# EAGLE design bq25504 (EAGLE 7.3.0)
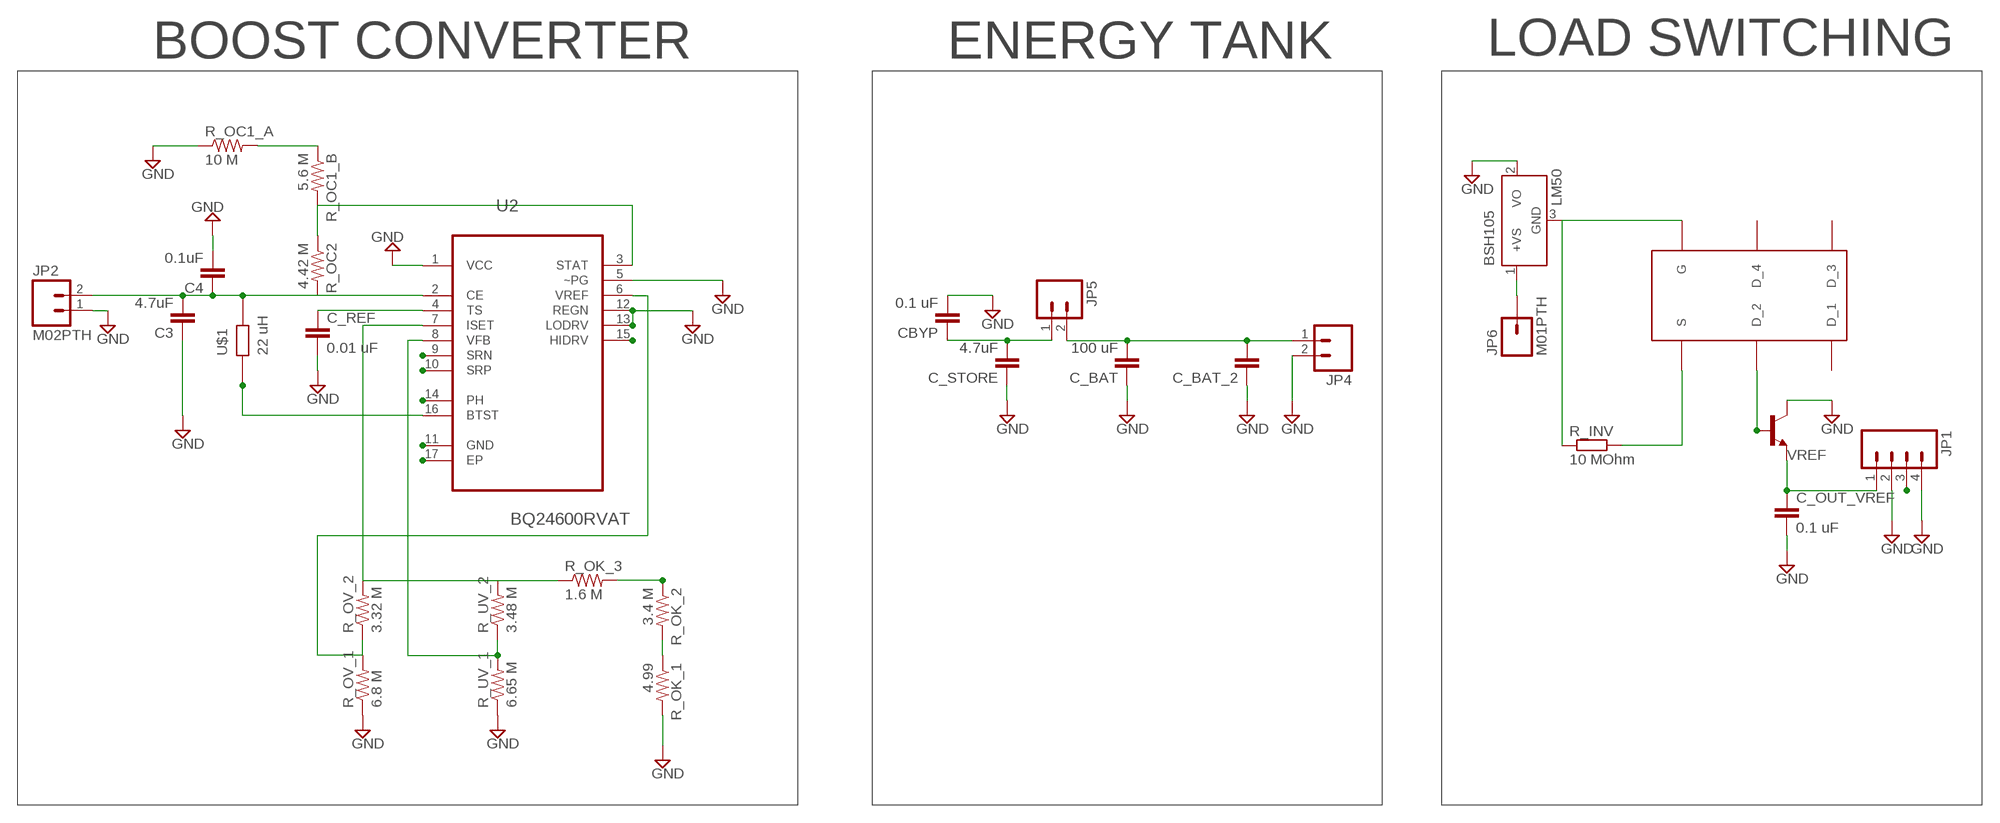
[diagram p0: schematic, sheet 1]

## Parts
BSH105  LM50  [SOT23]
BSH207  BSH_105_NMOS_DEV  [SOT457]
C3  4.7uF  1.0UF-25V-+80/-20(0805)  [0805]
C4  0.1uF  1.0UF-25V-+80/-20(0805)  [0805]
C_BAT  100 uF  CAP0805  [0805]
C_BAT_2  CAP1210  [1210]
C_OUT_VREF  0.1 uF  12PF-50V-5%(0603)  [0603-CAP]
C_REF  0.01 uF  CAP0805  [0805]
C_STORE  4.7uF  1.0UF-25V-+80/-20(0805)  [0805]
CBYP  0.1 uF  CAP0805  [0805]
JP1  M04LOCK  [1X04_LOCK]
JP2  M02PTH  [1X02]
JP4  M02PTH  [1X02]
JP5  M02PTH  [1X02]
JP6  M01PTH  [1X01]
R_INV  10 MOhm  R-EU_R0603  [R0603]
R_OC1_A  10 M  RESISTOR0805-RES  [0805]
R_OC1_B  5.6 M  RESISTOR0805-RES  [0805]
R_OC2  4.42 M  RESISTOR0805-RES  [0805]
R_OK_1  4.99  RESISTOR0805-RES  [0805]
R_OK_2  3.4 M  RESISTOR0805-RES  [0805]
R_OK_3  1.6 M  RESISTOR0805-RES  [0805]
R_OV_1  6.8 M  RESISTOR0805-RES  [0805]
R_OV_2  3.32 M  RESISTOR0805-RES  [0805]
R_UV_1  6.65 M  RESISTOR0805-RES  [0805]
R_UV_2  3.48 M  RESISTOR0805-RES  [0805]
U2  BQ24600RVAT  [QFN50P350X350X100-17N]
U$1  22 uH  LPS4018  [LPS4018]
VREF_1.8  TRANSISTOR_NPNSOT23-3  [SOT23-3]

## Nets
9_PIN: R_OK_2.1 R_OK_3.2 U2.9(SRN)
10_PIN: R_OK_1.1 R_OK_2.2 U2.10(SRP)
BAT_OK: BSH105.1(+VS) JP6.1 U2.11(GND)
BOOST_OUT: BSH207.2(D_2) JP1.3 VREF_1.8.1(B)
GND: BSH105.2(VO) C3.1 C4.2 C_BAT.1 C_BAT_2.1 C_OUT_VREF.2 C_REF.2 C_STORE.1 CBYP.2 JP1.2 JP1.4 JP2.1 JP4.2 R_OC1_A.1 R_OK_1.2 R_OV_1.1 R_UV_1.1 U2.1(VCC) U2.5(~PG) U2.12(REGN) U2.13(LODRV) VREF_1.8.3(C)
J: U2.16(BTST) U$1.A
N$5: C3.2 C4.1 JP2.2 R_OC2.2 U2.2(CE) U$1.B
N$9: R_OV_1.2 R_OV_2.1 U2.6(VREF)
N$11: R_OC1_B.2 R_OC2.1 U2.3(STAT)
N$13: R_UV_1.2 R_UV_2.1 U2.8(VFB)
N$14: C_REF.1 U2.4(TS)
N$15: R_OC1_A.2 R_OC1_B.1
N$16: C_OUT_VREF.1 JP1.1 VREF_1.8.2(E)
N$17: BSH105.3(GND) BSH207.3(G) R_INV.1
N$18: U2.17(EP)
V_BAT: BSH207.4(S) C_BAT.2 C_BAT_2.2 JP4.1 JP5.2 R_INV.2 U2.14(PH)
V_STORE: C_STORE.2 CBYP.1 JP5.1 U2.15(HIDRV)
WIRE: R_OK_3.1 R_OV_2.2 R_UV_2.2 U2.7(ISET)
Unconnected: BSH207.1(D_1) BSH207.5(D_3) BSH207.6(D_4)

## Notes on the sheet
- LOAD SWITCHING
- BOOST CONVERTER | ENERGY TANK
- VREF

## Library data of the parts
BSH105 = linear:LM50: SOT-23 Single-Supply Centigrade Temperature Sensor Vout = (10mV/°C x Temp °C) +5mmmV Source: http://cache.national.com/ds/LM/LM50.pdf
BSH207 = SparkFun-DiscreteSemi:BSH_105_NMOS_DEV: NXP BSH205 P_MOS Package SOT457 Type PMOS MOSFET TRANSISTOR WARNING! TYPO ON DEVICE NAME. IT IS BSH205_PMOS
C3 C4 C_STORE = SparkFun-Capacitors:1.0UF-25V-+80/-20(0805): CAP-11625; PROD_ID: CAP-11625; VALUE: 1.0uF
C_BAT C_REF CBYP = SparkFun:CAP: Capacitor Standard 0603 ceramic capacitor, and 0.1" leaded capacitor.
C_BAT_2 = SparkFun-Capacitors:CAP: Capacitor Standard 0603 ceramic capacitor, and 0.1" leaded capacitor.
C_OUT_VREF = SparkFun-Capacitors:12PF-50V-5%(0603): CAP-09137; PROD_ID: CAP-09137; VALUE: 12pF
JP1 = SparkFun-Connectors:M04: Header 4 Standard 4-pin 0.1" header. Use with straight break away headers (SKU : PRT-00116), right angle break away headers (PRT-00553), swiss pins (PRT-00743), machine pins (PRT-00117), and female headers (PRT-00115). Molex polarized connector foot print use with SKU : PRT-08231 with associated crimp pins and housings. 1MM SMD Version SKU: PRT-10208
JP2 = SparkFun-Connectors:M02: Standard 2-pin 0.1" header. Use with - straight break away headers ( PRT-00116) - right angle break away headers (PRT-00553) - swiss pins (PRT-00743) - machine pins (PRT-00117) - female headers (PRT-00115) Molex polarized connector foot print use with: PRT-08233 with associated crimp pins and housings. 2.54_SCREWTERM for use with PRT-10571. 3.5mm Screw Terminal footprints for PRT-08084 5mm Screw Terminal footprints for use with PRT-08432
JP4 JP5 = SparkFun:M02: Header 2 Standard 2-pin 0.1" header. Use with straight break away headers (SKU : PRT-00116), right angle break away headers (PRT-00553), swiss pins (PRT-00743), machine pins (PRT-00117), and female headers (PRT-00115). Molex polarized connector foot print use with SKU : PRT-08233 with associated crimp pins and housings.
JP6 = SparkFun:M01: Header 1 Standard 1-pin 0.1" header. Use with straight break away headers (SKU : PRT-00116), right angle break away headers (PRT-00553), swiss pins (PRT-00743), machine pins (PRT-00117), and female headers (PRT-00115).
R_INV = rcl:R-EU_: RESISTOR, European symbol
R_OC1_A R_OC1_B R_OC2 R_OK_1-R_OK_3 R_OV_1 R_OV_2 R_UV_1 R_UV_2 = SparkFun-Resistors:RESISTOR: Resistor Basic schematic elements and footprints for 0603, 1206, and PTH resistors.
U2 = Texas Instruments_By_element14_Batch_1:BQ24600RVAT: Synchronous Switch-Mode Li-Ion or Li-Polymer Battery Charger; MPN: BQ24600RVAT; OC_FARNELL: -; OC_NEWARK: 72R5026; PACKAGE: VQFN-16; SUPPLIER: Texas Instruments
U$1 = 3DRobotics_Master_Library:LPS4018: Coilcraft Shielded SMT power inductor 15uH inductor for LM2842 switching regulator application circuit.; DATASHEET: http://www.coilcraft.com/pdf_viewer/showpdf.cfm?f=pdf_store:lps4018.pdf; LINK: http://www.coilcraft.com/lps4018.cfm; MFGPN: LPS4018-153MLB
VREF_1.8 = SparkFun:TRANSISTOR_NPN: Transistor NPN BJT configuration in SOT23 package. MMBT2222 is the common NPN we use. Double check BCE configuration again layout.

## Board
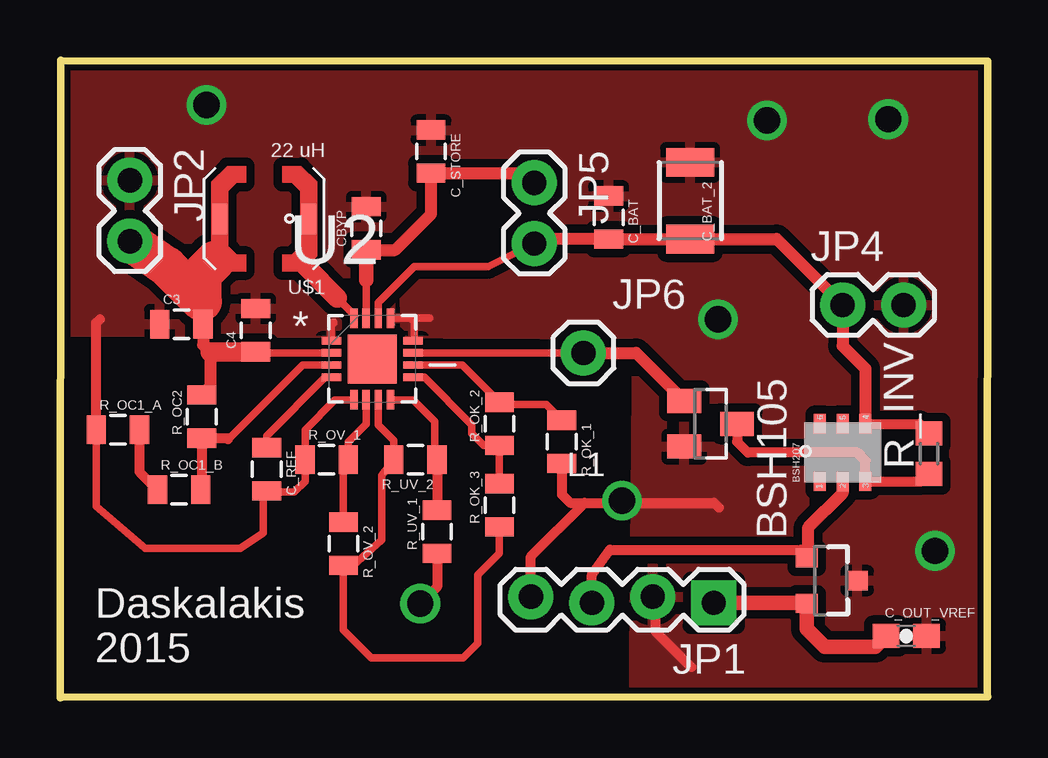
[diagram p1: board, top side]
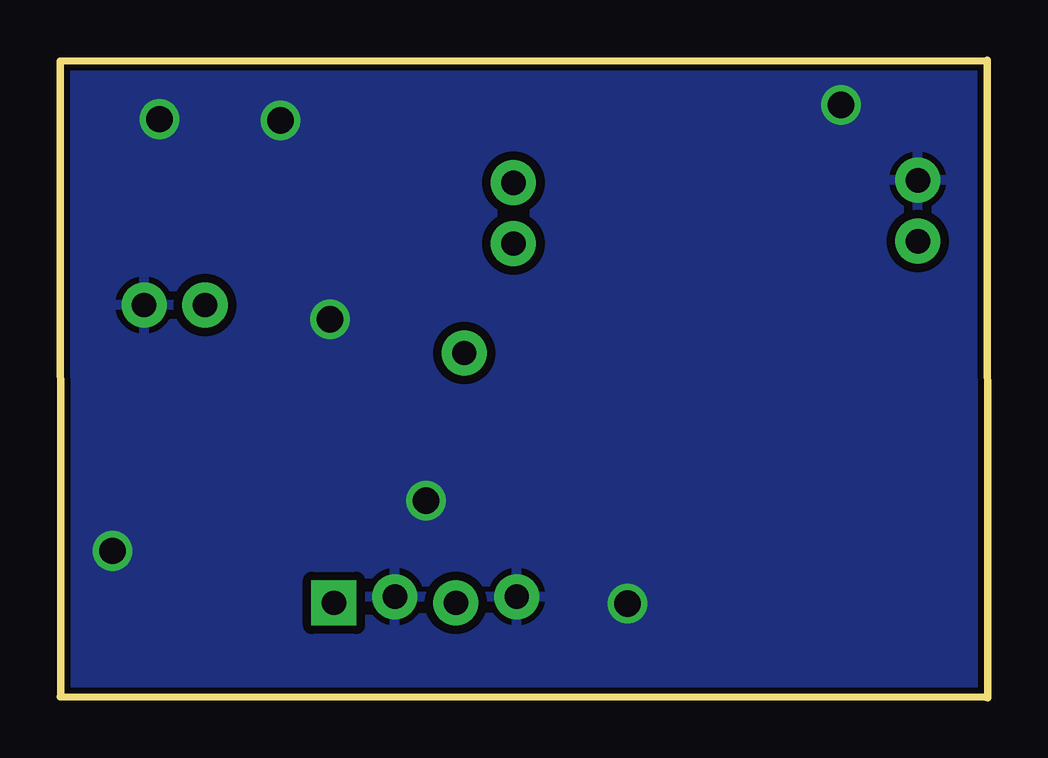
[diagram p2: board, bottom side, seen from below]

Size 38.65 x 26.59 mm. Coordinates in mm from the lower left corner, seen from the top.
Outline: 38.65,26.54 38.63,0.14
Outline: 0.03,26.59 0,0
Outline: 38.65,26.54 0.03,26.55
Outline: 0.07,0.02 38.65,0.03
Copper layers (1*16): Top 0.035mm / dielectric 1.5mm / Bottom 0.035mm
Design rules "Fusion_eagle_rule_v1.1 *": minimum track width 12mil, minimum drill 12mil, track to track 14mil, track to pad 14mil, pad to pad 14mil, via to via 14mil, smd to smd 0mil, copper to edge 10mil, drill to drill 10mil, minimum pad ring 10mil, minimum via ring 6mil, stop-mask expansion 2mil, vias tented up to drill 100mil, thermal gap 10mil

### Footprints (pad centres in the part's own frame; a part is rotated, then mirrored left to right if it is on the bottom)
SOT23 = smd 1 x 1.4: 1 -0.95,-1.1; 2 0.95,-1.1; 3 0,1.1
SOT457 = smd 0.8 x 0.5: 1 -1.2,0.95; 2 -1.2,0; 3 -1.2,-0.95; 4 1.2,-0.95; 5 1.2,0; 6 1.2,0.95
0805 = smd 0.8 x 1.2: 1 -0.9,0; 2 0.9,0
1210 = smd 1.2 x 2: 1 -1.6,0; 2 1.6,0
0603-CAP = smd 1.1 x 1: 1 -0.85,0; 2 0.85,0
1X04_LOCK = drill 1.016 pad 1.88 square: 1 0,0.127 | drill 1.016 pad 1.88: 2 2.54,-0.127; 3 5.08,0.127; 4 7.62,-0.127
1X02 = drill 1.016 pad 1.88: 1 0,0; 2 2.54,0
1X01 = drill 1.016 pad 1.88: 1 0,0
R0603 = smd 1 x 1.1: 1 -0.85,0; 2 0.85,0
QFN50P350X350X100-17N = smd 0.813 x 0.305: 1 -1.702,0.762; 2 -1.702,0.254; 3 -1.702,-0.254; 4 -1.702,-0.762; 9 1.702,-0.762; 10 1.702,-0.254; 11 1.702,0.254; 12 1.702,0.762 | smd 0.305 x 0.813: 5 -0.762,-1.702; 6 -0.254,-1.702; 7 0.254,-1.702; 8 0.762,-1.702; 13 0.762,1.702; 14 0.254,1.702; 15 -0.254,1.702; 16 -0.762,1.702 | smd 2.032 x 2.032: 17 0,0
LPS4018 = smd 0.635 x 1.27: A -1.85,0; B 1.85,0
SOT23-3 = smd 0.8 x 0.9: 1 -0.95,-1; 2 0.95,-1; 3 0,1.1

### Placement (x,y rotation side)
BSH105  27.11,11.42 270 top
BSH207  32.61,10.22 90 top
C3  5.06,15.57 0 top
C4  8.16,15.32 90 top
C_BAT  22.86,20.02 270 top
C_BAT_2  26.26,20.72 270 top
C_OUT_VREF  35.26,2.57 0 top
C_REF  8.61,9.52 270 top
C_STORE  15.46,22.77 270 top
CBYP  12.76,19.57 90 top
JP1  27.24,4.08 180 top
JP2  2.91,21.57 270 top
JP4  32.61,16.37 0 top
JP5  19.76,21.47 270 top
JP6  21.81,14.37 0 top
R_INV  36.21,10.17 90 top
R_OC1_A  2.41,11.17 0 top
R_OC1_B  4.96,8.67 0 top
R_OC2  5.91,11.72 90 top
R_OK_1  20.91,10.67 270 top
R_OK_2  18.31,11.42 90 top
R_OK_3  18.31,8.02 90 top
R_OV_1  11.11,9.92 0 top
R_OV_2  11.81,6.42 270 top
R_UV_1  15.71,6.92 90 top
R_UV_2  14.81,9.92 180 top
U2  13.01,14.12 0 top
U$1  8.51,19.97 180 top
VREF_1.8  32.11,4.88 270 top

### Tracks (layer width: path | path; a pad name or v marks a point on that pad's centre or on a via)
9_PIN
  Top 0.305: U2.9 15.17,13.36 17.16,11.37 17.16,11.02 17.66,10.52 R_OK_2.1 R_OK_3.2
10_PIN
  Top 0.305: U2.10 16.76,13.87 R_OK_2.2 18.41,12.32 18.51,12.22 20.26,12.22 R_OK_1.1
BAT_OK
  Top 0.305: U2.11 JP6.1
  Top 0.5: JP6.1 24.01,14.37 BSH105.1
BOOST_OUT
  Top 0.406: JP1.3 22.16,5.12 22.91,6.17 30.87,6.17 VREF_1.8.1
  Top 0.5: BSH207.2 32.61,8.52 31.16,7.07 31.16,5.88 VREF_1.8.1
GND  (via drill 1.1)
  Top 0.305: 11.36,15.57 11.31,15.57 U2.1 11.31,15.52 11.36,15.57 | 11.36,15.57 11.41,15.62 11.36,15.62 | U2.5 11.46,12.42 10.21,11.17 R_OV_1.1 10.21,9.02 9.76,8.57 8.66,8.57 | 8.66,8.57 C_REF.2 | 8.66,8.57 8.51,8.57 8.46,8.62 8.46,6.87 7.51,6.22 3.56,6.22 1.51,7.97 R_OC1_A.1 | U2.12 14.76,14.93 14.76,15.67 14.61,15.82 U2.13 15.41,15.82 | 11.31,15.62 11.36,15.62 | 11.36,15.62 11.41,15.67
  Top 0.406: R_OC1_A.1 1.51,15.62 1.66,15.77 | R_UV_1.1 15.71,4.62 v15.01,3.92 | R_OK_1.2 20.91,8.47 21.26,8.12 21.86,8.12 | 21.86,8.12 27.26,8.12 27.46,7.92 | JP1.4 19.62,5.88 21.86,8.12 | 24.81,4.27 24.81,2.77 26.31,1.27
  other vias: 29.46,24.07 6.11,24.72 27.41,15.77 23.41,8.22 34.51,24.12 36.46,6.12
  pour Top: -4.29,28.97 43.61,28.97 43.46,-0.58 23.91,-0.58 24.06,15.12 -4.24,15.27 -4.44,29.12
  pour Bottom: -0.69,27.12 39.11,27.12 39.11,0.52 -0.79,0.52 -0.79,27.07
J
  Top 0.305: U2.16 12.25,15.98 11.56,16.67 | 10.21,18.02 10.21,19.82 U$1.A
  Top 0.813: 11.56,16.67 10.21,18.02
N$5
  Top 0.305: U2.2 8.21,14.37 C4.1 | 6.46,18.22 6.46,19.77 U$1.B
  Top 0.5: 5.91,16.52 5.91,15.62 C3.2 5.96,14.72 6.26,14.42 6.26,12.97 R_OC2.2
  Top 0.813: C4.1 6.26,14.42
  Top 1.676: 6.46,18.22 5.91,17.67 5.91,16.52 4.45,17.98 JP2.2
N$9
  Top 0.305: U2.6 12.76,11.42 12.01,10.67 R_OV_1.2 11.81,9.72 R_OV_2.1
N$11
  Top 0.305: U2.3 10.11,13.87 7.01,10.77
  Top 0.406: R_OC1_B.2 5.91,8.72 R_OC2.1 6.96,10.82 7.01,10.77
N$13
  Top 0.305: U2.8 14.71,12.42 15.61,11.52 15.61,10.02 R_UV_2.1
  Top 0.406: R_UV_2.1 R_UV_1.2
N$14
  Top 0.305: U2.4 11.05,13.36 8.61,10.92 C_REF.1
N$15
  Top 0.406: R_OC1_A.2 3.31,9.42 R_OC1_B.1
N$16
  Top 0.61: JP1.1 31.09,3.95 VREF_1.8.2 31.11,2.87 31.86,2.12 33.96,2.12 C_OUT_VREF.1
N$17
  Top 0.406: R_INV.1 35.91,9.02 BSH207.3 33.56,9.87 33.21,10.22 28.66,10.22 28.21,10.67 BSH105.3
V_BAT
  Top 0.305: U2.14 13.26,16.47 14.76,17.97 17.85,17.97 JP5.2
  Top 0.406: BSH207.4 35.81,11.42 R_INV.2
  Top 0.5: JP5.2 19.95,19.12 C_BAT.2 C_BAT_2.2 | C_BAT_2.2 26.71,19.12 26.86,18.97 26.41,18.97 C_BAT_2.2 | C_BAT_2.2 29.86,19.12 JP4.1 32.61,14.67 33.56,13.72 BSH207.4
V_STORE
  Top 0.305: U2.15 12.76,17.12 12.76,17.42
  Top 0.5: CBYP.1 13.96,18.67 15.46,20.17 C_STORE.2 19.36,21.87 JP5.1
  Top 0.61: 12.76,17.42 CBYP.1
WIRE
  Top 0.305: U2.7 13.26,11.37 13.91,10.72 R_UV_2.2 13.41,9.27 13.41,6.57 12.21,5.52 R_OV_2.2 11.81,2.82 12.96,1.67 16.81,1.67 17.41,2.27 17.41,5.12 18.31,6.02 R_OK_3.1

### Text on the board
tPlace: L1 | Daskalakis / 2015